# Altium schematic sheet INH v4.01.SchDoc
size A4; SheetNumber: 1; SheetTotal: 1; SPICEModelCacheQSLYWCYP: <root> / <DocumentId>QSLYWCYP</DocumentId> / <CacheFrame Number="0"> / <Model Name="diode" Kind="MDL"> / <Text>.MODEL diode D ()</Text> / </Model> / <Model Name="nmosfet_level1" Kind="MDL"> / <Text>*----------------------------------------------------------------------------------------------------------------------- / *MOSFETs / *--------------------------------------------------------------------------------------------------------------------- / *MOS1 Shichman and Hodges Models / .model NMOSFET_Level1 nmos (Level=1) </Text> / </Model> / <Model Name="spst_switch" Kind="CKT"> / <Text>*------------------------- / *SPST Sw Button / * state: if closed&gt;0 - closed else open / * Rclosed -  Closed state resistance / * Ropen -  Open state resistance (Ropen/Rclosed &lt; 1E10) / .SUBCKT  SPST_Switch node1  node2  PARAMS: / + closed=0 / + Rclosed=1m / + Ropen=1Meg / B1 int1 0 V={if(closed&gt;0,1,0)} / S1 node1 node2 int1 0 Smod / .model Smod Vswitch(Ron={Rclosed} Roff={Ropen}) / .ends</Text> / </Model> / </CacheFrame> / </root>
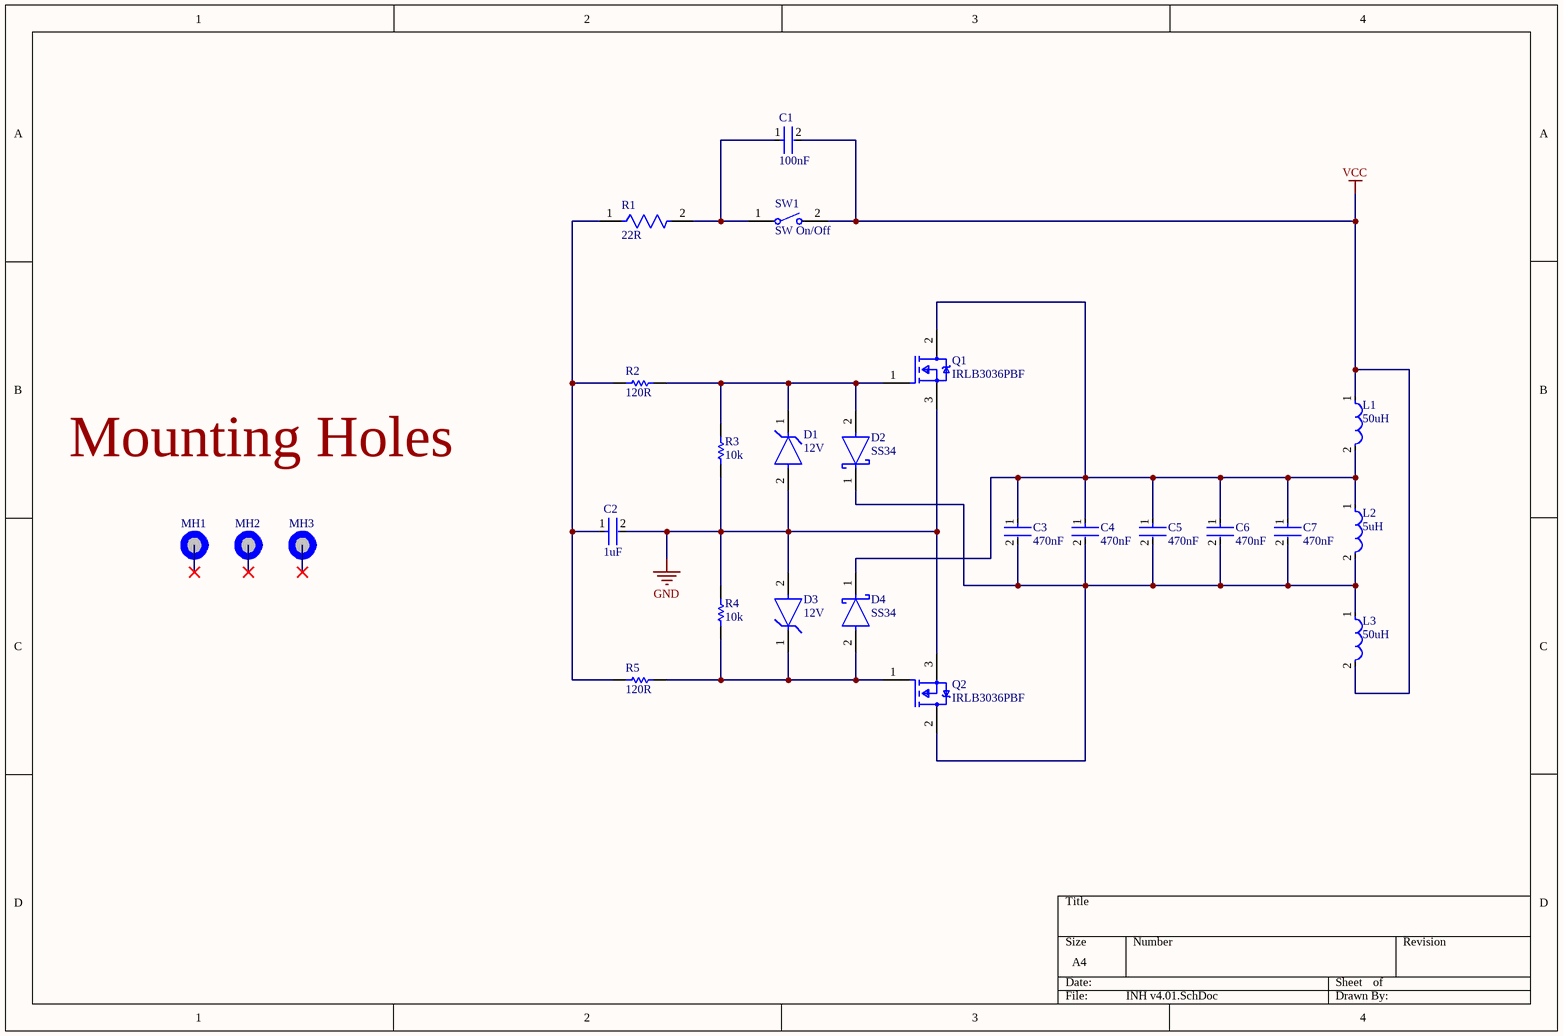
[diagram p0: INH v4.01.SchDoc]

## Parts
C1  100nF  [1206 Capacitor]
C2  1uF  [1206 Capacitor]
C3  470nF  [THT Capacitor P15mm (84x183mm)]
C4  470nF  [THT Capacitor P15mm (84x183mm)]
C5  470nF  [THT Capacitor P15mm (84x183mm)]
C6  470nF  [THT Capacitor P15mm (84x183mm)]
C7  470nF  [THT Capacitor P15mm (84x183mm)]
D1  12V  [DO-41]
D2  SS34  [DO-214]
D3  12V  [DO-41]
D4  SS34  [DO-214]
L1  50uH  [L 50uh]
L2  5uH  [L Main]
L3  50uH  [L 50uh]
MH1  Mounting Hole m3  [Mounting Hole m3]  (value not drawn)  (no BOM)
MH2  Mounting Hole m3  [Mounting Hole m3]  (value not drawn)  (no BOM)
MH3  Mounting Hole m3  [Mounting Hole m3]  (value not drawn)  (no BOM)
Q1  IRLB3036PBF  [FP-PG-TO220-3-MFG]
Q2  IRLB3036PBF  [FP-PG-TO220-3-MFG]
R1  22R  [FP-CRCW2512-e3-MFG]
R2  120R  [RESC2013X60X40ML20T25]
R3  10k  [RESC2013X60X35ML10T20]
R4  10k  [RESC2013X60X35ML10T20]
R5  120R  [RESC2013X60X40ML20T25]
SW1  SW On/Off  [SW On/Off]

## Nets
GND: C2.2 D1.2(A) D3.2(A) Q1.3(SOURCE) Q2.3(SOURCE) R3.1 R4.2
VCC: C1.2 L1.1 L3.2 SW1.2
NetC1_1: C1.1 R1.2 SW1.1
NetC2_1: C2.1 R1.1 R2.1 R5.1
NetC3_1: C3.1 C4.1 C5.1 C6.1 C7.1 D4.1(C) L1.2 L2.1 Q1.2(DRAIN)
NetC3_2: C3.2 C4.2 C5.2 C6.2 C7.2 D2.1(C) L2.2 L3.1 Q2.2(DRAIN)
NetD1_1: D1.1(C) D2.2(A) Q1.1(GATE) R2.2 R3.2
NetD3_1: D3.1(C) D4.2(A) Q2.1(GATE) R4.1 R5.2

## Notes on the sheet
- Mounting Holes

## Library data of the parts
C1 = C 1206 100nF
C2 = C 1206 1uF: Cap Ceramic 1uF 25V X7R ±20% SMD 1206 +125°C Embossed T/R; Radiation Hardening: No; Height: 1.6mm; Mount: Surface Mount; Packaging: Tape and Reel; Width: 0.063inch; Contact Plating: Tin; Package Quantity: 1; Thickness: 0.071inch; Tolerance: 20%; Case/Package: 1206; Length: 3.2mm; Case Code (Imperial): 1206; Dielectric: X7R; Voltage Rating: 25V; Depth: 1.6mm; Voltage Rating (DC): 25V; Max Operating Temperature: 125°C; Case Code (Metric): 3216; Min Operating Temperature: -55°C; Lead Free: Lead Free; Capacitance: 1uF
C3-C7 = C 084x183 P15 470nF: PP X2 Capacitor 470nF 275V
D1 D3 = DZ DO-41 12v: BZX85C10-T50R Zener Diode, 12V V(Z), 2%, 1W, Silicon, Unidirectional, DO-41; NexarPartId: 84793728; Manufacturer Lifecycle Status: ACTIVE; Impedance: 7Ω; Zener Current: 25mA; Max Reverse Leakage Current: 500nA; Element Configuration: Single; ESD Protection: No; Voltage Tolerance: 5%; Lead Free: Lead Free; Weight: 245mg; Mount: Through Hole; Contact Plating: Tin; Lifecycle Status: Production; Power Dissipation: 1W; Max Power Dissipation: 1W; RoHS: Compliant; Packaging: Tape & Reel; Voltage Rating (DC): 12V; Zener Voltage: 12V; Max Operating Temperature: 200°C; Test Current: 25mA; Number of Pins: 2; Tolerance: 5%; Min Operating Temperature: -65°C; Power Rating: 1W
D2 D4 = D DO-214 Schottky: DIODE SCHOTTKY 40V 3A DO214AB; Manufacturer: Vishay; Manufacturer Part Number: SS34-E3/57T; Max Junction Temp: +150°C; Peak Reverse Current: 0.5mA; Max Surge Forward Current: 100A; Standoff Height: 0mm; ComponentLink2Description: Datasheet; Device Class L3: Schottky Diodes; Height: 2.62mm; Max Repetitive Reverse Voltage: 40V; Lead Free: Yes; Package: 95402; Temperature Range High: +150°C; ComponentLink2URL: http://www.vishay.com/docs/88751/ss32.pdf; Temperature: -55°C to +150°C; Footprint Url: http://www.vishay.com/docs/95402/smc.pdf; Automotive: No; Forward Current: 3A; Category: Diode; RoHS: TRUE; Device Class L2: Diodes; Mouser Description: Schottky Diodes & Rectifiers 3.0 Amp 40 Volt; Octopart: https://octopart.com/ss34-e3%2F57t-vishay-39552907; Temperature Range Low: -55°C; Device Class L1: Discrete Semiconductors; Digikey Description: DIODE SCHOTTKY 40V 3A DO214AB
L1 L3 = L 50uH
L2 = L Main
Q1 Q2 = Q TO-220 IRLB3036PBF: MOSFET N-CH 60V 195A TO220AB; NexarPartId: 65874922; Max Junction Temperature (Tj): 175°C; Turn-On Delay Time: 66ns; Element Configuration: Single; Turn-Off Delay Time: 110ns; Resistance: 2.4MΩ; Threshold Voltage: 2.5V; Power Dissipation: 380W; Number of Channels: 1; Input Capacitance: 11.21nF; Drain to Source Resistance: 1.9mΩ; Rise Time: 220ns; Gate to Source Voltage (Vgs): 16V; REACH SVHC: No SVHC; RoHS: Compliant; Drain to Source Voltage (Vdss): 60V; Lead Free: Lead Free; Drain to Source Breakdown Voltage: 60V; Max Operating Temperature: 175°C; Rds On Max: 2.4mΩ; Case/Package: TO-220AB; Package Quantity: 1000; Mount: Through Hole; On-State Resistance: 2.4mΩ; Schedule B: 8541290080|8541290080|8541290080|8541290080|8541290080|8541290080|8541290080|8541290080|8541290080|8541290080|8541290080|8541290080|8541290080|8541290080|8541290080|8541290080|8541290080|8541290080|8541290080|8541290080|8541290080|8541290080|8541290080|85; Min Operating Temperature: -55°C; Continuous Drain Current (ID): 195A; Number of Elements: 1; Height: 9.02mm; Number of Pins: 3; Lifecycle Status: Production; Max Power Dissipation: 380W
R1 = CMP-02407-005306-1: RES Thick Film, 22Ω, 5%, 1W, 200ppm/°C, 2512; Voltage Rating: 500V; Termination: Solder; Length: 6.3mm; Height: 0.6mm; Case Code (Imperial): 2512; Package Quantity: 1; Radiation Hardening: No; Lead Free: Lead Free; Resistance: 22R; Temperature Coefficient: 200ppm/°C; Max Operating Temperature: 155°C; Depth: 3.15mm; Power Rating: 1W; Case Code (Metric): 6432; Case/Package: 2512; Tolerance: 5%; Features: Automotive AEC-Q200; Voltage Rating (DC): 500V; Max Power Dissipation: 1W; Packaging: Tape and Reel; Contact Plating: Tin; Min Operating Temperature: -55°C; Composition: Thick Film; Military Standard: Not; Number of Terminations: 2; Mount: Surface Mount; Weight: 0.001429oz; Width: 0.124inch
R2 R5 = CMP-2001-00588-1: Manufacturer: Panasonic; Part Number: ERA6AEB121V
R3 R4 = CMP-1659-00013-4: Chip Resistor, 10 KOhm, +/- 1%, 0.125 W, -55 to 155 degC, 0805 (2012 Metric), RoHS, Tape and Reel; Manufacturer: Yageo; Voltage Rating: 150 V; Mount: Surface Mount; ComponentLink1Description: Manufacturer URL; ComponentLink2URL: http://www.yageo.com/documents/recent/PYu-RC_Group_51_RoHS_L_04.pdf; Pins: 2; Length: 2 mm; Min Operating Temperature: -55 degC; Height: 0.5 mm; Mounting Technology: Surface Mount; RoHSCompliant: true; REACH SVHC: No SVHC; ComponentLink1URL: http://www.yageo.com/; Max Operating Temperature: 155 degC; PackageReference: 0805; DatasheetVersion: Rev. 4, 02/2016; Package Quantity: 5000; Packaging: Tape and Reel; ComponentLink2Description: Datasheet; PackageDescription: 2-Pin Surface Mounted Device, Body 2 x 1.25 mm
SW1 = SW On/Off: Push Button Switch; Manufacturer: TE Connectivity; Voltage Rating (DC): 24V; Electrical Life: 20000Cycles; Operating Force: 180gf; Switch Travel: 0.25mm; Contact Current Rating: 50mA; Case\/Package: SMD/SMT; Actuator Length: 1.07mm; Throw Configuration: SPST; Actuator Material: Polyamide; Contact Resistance: 100mOhm; Illumination Type: Illuminated; Max Voltage Rating (DC): 12V; Manufacturer URL: http://www.te.com/; Lead Free: LeadFree; Packaging: TapeandReel; Min Operating Temperature: -35degC; Mechanical Life: 20000Cycles; Mount: SurfaceMount; REACH SVHC: Unknown; Package Quantity: 1800; Package Reference: FSMSMTR; RoHSCompliant: true; Max Operating Temperature: 85degC; Orientation: Straight; ELV: Compliant; Datasheet URL: http://www.te.com/commerce/DocumentDelivery/DDEController?Action=showdoc&DocId=Customer+Drawing%7F1437566-3%7FC2%7Fpdf%7FEnglish%7FENG_CD_1437566-3_C2_1437566_3_1_c.dwg.pdf%7F1437566-4; Package Description: 2-Pin Surface Mount Device, Body 6 x 3.5 mm, Pitch 9.19 mm; Current Rating: 50mA; Contact Plating: Silver; Termination: GullWing; Datasheet Version: Rev. C2, 08/2014; Contact Material: Brass; Mounting Technology: SurfaceMount